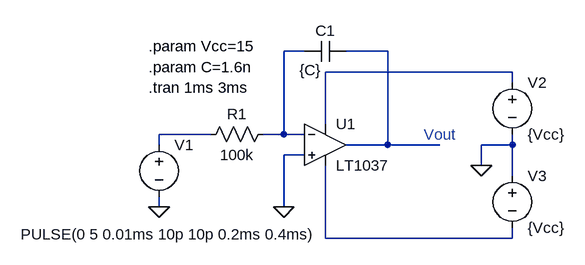
[diagram p0: schematic scheme8.asc]
scheme8.asc, the LTspice schematic file:
Version 4.1
SHEET 1 880 680
WIRE 352 16 320 16
WIRE 480 16 416 16
WIRE 672 48 384 48
WIRE 672 64 672 48
WIRE 384 128 384 48
WIRE 208 144 128 144
WIRE 320 144 320 16
WIRE 320 144 288 144
WIRE 352 144 320 144
WIRE 128 160 128 144
WIRE 480 160 480 16
WIRE 480 160 416 160
WIRE 560 160 480 160
WIRE 672 160 672 144
WIRE 672 160 624 160
WIRE 352 176 320 176
WIRE 624 192 624 160
WIRE 672 208 672 160
WIRE 128 256 128 240
WIRE 320 256 320 176
WIRE 384 304 384 192
WIRE 672 304 672 288
WIRE 672 304 384 304
FLAG 320 256 0
FLAG 128 256 0
FLAG 624 192 0
SYMBOL voltage 128 144 R0
WINDOW 3 -213 154 Left 2
WINDOW 123 -82 171 Left 2
WINDOW 39 0 0 Left 0
SYMATTR Value PULSE(0 5 0.01ms 10p 10p 0.2ms 0.4ms)
SYMATTR InstName V1
SYMBOL res 304 128 R90
WINDOW 0 0 56 VBottom 2
WINDOW 3 32 56 VTop 2
SYMATTR InstName R1
SYMATTR Value 100k
SYMBOL cap 416 0 R90
WINDOW 0 0 32 VBottom 2
WINDOW 3 29 55 VTop 2
SYMATTR InstName C1
SYMATTR Value {C}
SYMBOL OpAmps\\LT1037 384 96 R0
SYMATTR InstName U1
SYMBOL voltage 672 48 R0
SYMATTR InstName V2
SYMATTR Value {Vcc}
SYMBOL voltage 672 192 R0
SYMATTR InstName V3
SYMATTR Value {Vcc}
TEXT 536 144 Left 2 ;Vout
TEXT 112 8 Left 2 !.param Vcc=15
TEXT 112 40 Left 2 !.param C=1.6n
TEXT 112 72 Left 2 !.tran 1ms 3ms

The netlist it stands for:
* scheme8.asc
V1 N004 0 PULSE(0 5 0.01ms 10p 10p 0.2ms 0.4ms)
R1 N001 N004 100k
C1 N002 N001 {C}
X§U1 0 N001 N003 N005 N002 LT1037  ; pins In+ In- V+ V- OUT
V2 N003 0 {Vcc}
V3 0 N005 {Vcc}
* Vout
.param Vcc=15
.param C=1.6n
.tran 1ms 3ms
.backanno
.end